# Altium schematic sheet TDA2004.SchDoc
size A4
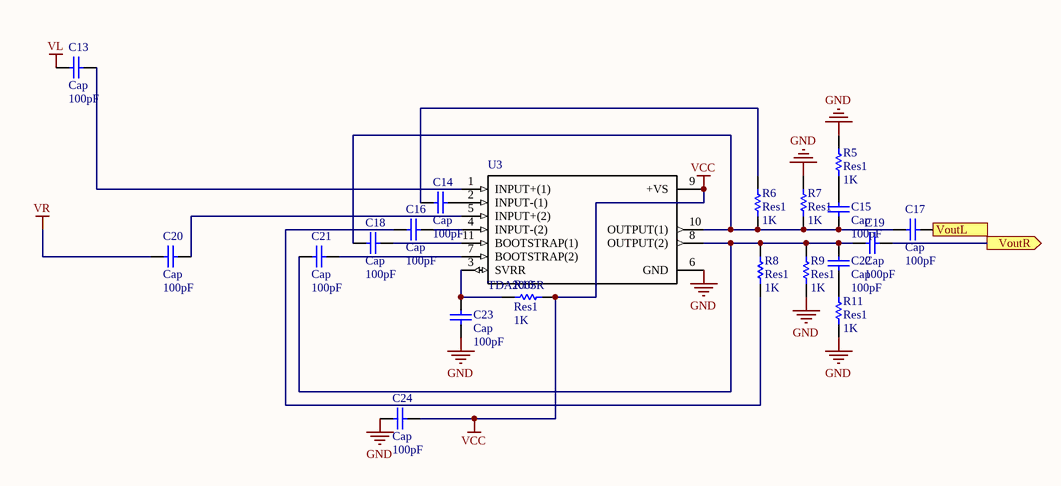
[diagram p0: TDA2004.SchDoc]

## Parts
C13  Cap  value 100pF  [RAD-0.3]
C14  Cap  value 100pF  [RAD-0.3]
C15  Cap  value 100pF  [RAD-0.3]
C16  Cap  value 100pF  [RAD-0.3]
C17  Cap  value 100pF  [RAD-0.3]
C18  Cap  value 100pF  [RAD-0.3]
C19  Cap  value 100pF  [RAD-0.3]
C20  Cap  value 100pF  [RAD-0.3]
C21  Cap  value 100pF  [RAD-0.3]
C22  Cap  value 100pF  [RAD-0.3]
C23  Cap  value 100pF  [RAD-0.3]
C24  Cap  value 100pF  [RAD-0.3]
R5  Res1  value 1K  [AXIAL-0.3]
R6  Res1  value 1K  [AXIAL-0.3]
R7  Res1  value 1K  [AXIAL-0.3]
R8  Res1  value 1K  [AXIAL-0.3]
R9  Res1  value 1K  [AXIAL-0.3]
R10  Res1  value 1K  [AXIAL-0.3]
R11  Res1  value 1K  [AXIAL-0.3]
U3  TDA2005R  [TO170P500X1990X2138-11P]

## Ports
VoutL (out), VoutR (out)

## Nets
GND: C23.1 C24.1 R5.2 R7.2 R9.1 R11.1 U3.6(GND)
VCC: C24.2 R10.2 U3.9(+VS)
VL: C13.1
VR: C20.1
VoutL: C17.2 ; port VoutL
VoutR: C19.2 ; port VoutR
NetC13_2: C13.2 U3.1(INPUT+(1))
NetC14_1: C14.1 R6.2
NetC14_2: C14.2 U3.2(INPUT-(1))
NetC15_1: C15.1 C17.1 C18.1 R6.1 R7.1 U3.10(OUTPUT(1))
NetC15_2: C15.2 R5.1
NetC16_1: C16.1 R8.1
NetC16_2: C16.2 U3.4(INPUT-(2))
NetC18_2: C18.2 U3.11(BOOTSTRAP(1))
NetC19_1: C19.1 C21.1 C22.2 R8.2 R9.2 U3.8(OUTPUT(2))
NetC20_2: C20.2 U3.5(INPUT+(2))
NetC21_2: C21.2 U3.7(BOOTSTRAP(2))
NetC22_1: C22.1 R11.2
NetC23_2: C23.2 R10.1 U3.3(SVRR)

## Library data of the parts
C13-C24 = Cap: Capacitor; Published: 8-Jun-2000; LatestRevisionDate: 17-Jul-2002; LatestRevisionNote: Re-released for DXP Platform.; PackageReference: RAD-0.3; Publisher: Altium Limited; PackageDescription: Radial Cap, Thru-Hole; 2 Leads; 0.3 in Pin Spacing
R5-R11 = Res1: Resistor; Published: 8-Jun-2000; LatestRevisionDate: 17-Jul-2002; LatestRevisionNote: Re-released for DXP Platform.; PackageReference: AXIAL-0.3; Publisher: Altium Limited; PackageDescription: Axial Device, Thru-Hole; 2 Leads; 0.3 in Pin Spacing
U3 = TDA2005R: Audio Amp Speaker 1-CH Mono/2-CH Stereo 22W Class-B Automotive 11-Pin_11+Tab_ MULTIWATT Tube; MF: STMicroelectronics; MP: TDA2005R; SnapEDA_Link: https://www.snapeda.com/parts/TDA2005R/STMicroelectronics/view-part/?ref=snap; Package: Multiwatt-11 STMicroelectronics; Digi-Key_Part_Number: *; Digi-Key_Purchase_URL: *; Value: *